# EAGLE design controller (EAGLE 5.12)
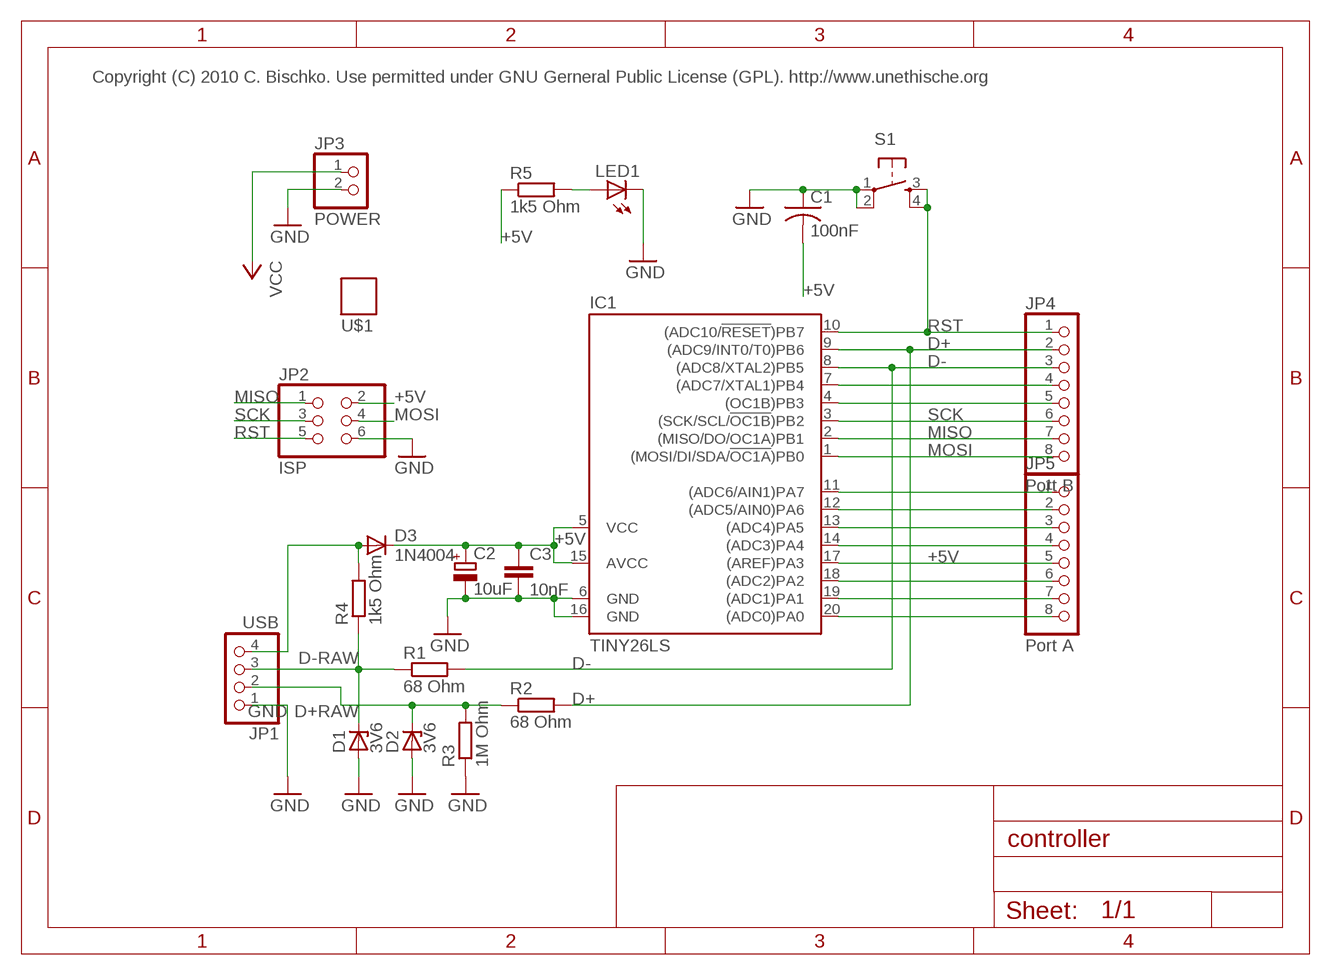
[diagram p0: schematic, sheet 1]

## Parts
C1  100nF  C-USC0805K  [C0805K]
C2  10uF  CPOL-EUE3.5-8  [E3,5-8]
C3  10nF  CAP0805  [0805]
D1  3V6  ZENER-DIODEC1702-15  [C1702-15]
D2  3V6  ZENER-DIODEC1702-15  [C1702-15]
D3  1N4004  [DO41-10]
IC1  TINY26LS  [SO20L]
JP1  USB  PINHD-1X4  [1X04]
JP2  ISP  PINHD-2X3  [2X03]
JP3  POWER  PINHD-1X2  [1X02]
JP4  Port B  PINHD-1X8  [1X08]
JP5  Port A  PINHD-1X8  [1X08]
LED1  LEDCHIPLED_0805  [CHIPLED_0805]
R1  68 Ohm  R-EU_R0805W  [R0805W]
R2  68 Ohm  R-EU_R0805W  [R0805W]
R3  1M Ohm  R-EU_R0805W  [R0805W]
R4  1k5 Ohm  R-EU_R0805W  [R0805W]
R5  1k5 Ohm  R-EU_R0805W  [R0805W]
S1  TAC_SWITCHPTH  [TACTILE-PTH]
U$1  UNETHILOGO  [UNETHILOGO]

## Nets
+5V: C1.2 C2.+ C3.1 D3.C IC1.5(VCC) IC1.15(AVCC) IC1.17((AREF)PA3) JP2.2 JP5.5 R5.1
D+: IC1.9((ADC9/INT0/T0)PB6) JP4.2 R2.2
D+RAW: D2.C JP1.2 R2.1 R3.2
D-: IC1.8((ADC8/XTAL2)PB5) JP4.3 R1.2
D-RAW: D1.C JP1.3 R1.1 R4.1
GND: C1.1 C2.- C3.2 D1.A D2.A IC1.6(GND) IC1.16(GND) JP1.1 JP2.6 JP3.2 LED1.C R3.1 S1.1 S1.2
MISO: IC1.2((MISO/DO/OC1A)PB1) JP2.1 JP4.7
MOSI: IC1.1((MOSI/DI/SDA/!OC1A!)PB0) JP2.4 JP4.8
N$3: LED1.A R5.2
N$4: IC1.7((ADC7/XTAL1)PB4) JP4.4
N$5: IC1.4((OC1B)PB3) JP4.5
N$7: IC1.20((ADC0)PA0) JP5.8
N$11: IC1.11((ADC6/AIN1)PA7) JP5.1
N$12: IC1.12((ADC5/AIN0)PA6) JP5.2
N$13: IC1.13((ADC4)PA5) JP5.3
N$14: IC1.14((ADC3)PA4) JP5.4
N$15: IC1.18((ADC2)PA2) JP5.6
N$16: IC1.19((ADC1)PA1) JP5.7
RST: IC1.10((ADC10/!RESET!)PB7) JP2.5 JP4.1 S1.3 S1.4
SCK: IC1.3((SCK/SCL/!OC1B!)PB2) JP2.3 JP4.6
VCC: D3.A JP1.4 JP3.1 R4.2

## Notes on the sheet
- Copyright (C) 2010 C. Bischko. Use permitted under GNU Gerneral Public License (GPL). http://www.unethische.org

## Library data of the parts
C1 = rcl:C-US: CAPACITOR, American symbol
C2 = rcl:CPOL-EU: POLARIZED CAPACITOR, European symbol
C3 = SparkFun:CAP: Capacitor Standard 0603 ceramic capacitor, and 0.1" leaded capacitor.
D1 D2 = diode:ZENER-DIODE: Z-Diode
D3 = diode:1N4004: DIODE general purpose rectifier, 1 A
IC1 = atmel:TINY26*: 8-bit AVR Microcontroller with 2K Bytes Flash Source: http://www.atmel.com .. doc1477.pdf
JP1 = pinhead:PINHD-1X4: PIN HEADER
JP2 = pinhead:PINHD-2X3: PIN HEADER
JP3 = pinhead:PINHD-1X2: PIN HEADER
JP4 JP5 = pinhead:PINHD-1X8: PIN HEADER
LED1 = led:LED: LED OSRAM: - CHIPLED LG R971, LG N971, LY N971, LG Q971, LY Q971, LO R971, LY R971 LH N974, LH R974 LS Q976, LO Q976, LY Q976 LO Q996 - Hyper CHIPLED LW Q18S LB Q993, LB Q99A, LB R99A - SideLED LS A670, LO A670, LY A670, LG A670, LP A670 LB A673, LV A673, LT A673, LW A673 LH A674 LY A675 LS A676, LA A676, LO A676, LY A676, LW A676 LS A679, LY A679, LG A679 - Hyper Micro SIDELED® LS Y876, LA Y876, LO Y876, LY Y876 LT Y87S - SmartLED LW L88C, LW L88S LB L89C, LB L89S, LG L890 LS L89K, LO L89K, LY L89K LS L896, LA L896, LO L896, LY L896 - TOPLED LS T670, LO T670, LY T670, LG T670, LP T670 LSG T670, LSP T670, LSY T670, LOP T670, LYG T670 LG T671, LOG T671, LSG T671 LB T673, LV T673, LT T673, LW T673 LH T674 LS T676, LA T676, LO T676, LY T676, LB T676, LH T676, LSB T676, LW T676 LB T67C, LV T67C, LT T67C, LS T67K, LO T67K, LY T67K, LW E67C LS E67B, LA E67B, LO E67B, LY E67B, LB E67C, LV E67C, LT E67C LW T67C LS T679, LY T679, LG T679 LS T770, LO T770, LY T770, LG T770, LP T770 LB T773, LV T773, LT T773, LW T773 LH T774 LS E675, LA E675, LY E675, LS T675 LS T776, LA T776, LO T776, LY T776, LB T776 LHGB T686 LT T68C, LB T68C - Hyper Mini TOPLED® LB M676 - Mini TOPLED Santana® LG M470 LS M47K, LO M47K, LY M47K Source: http://www.osram.convergy.de LUXEON: - LUMILED® LXK2-PW12-R00, LXK2-PW12-S00, LXK2-PW14-U00, LXK2-PW14-V00 LXK2-PM12-R00, LXK2-PM12-S00, LXK2-PM14-U00 LXK2-PE12-Q00, LXK2-PE12-R00, LXK2-PE12-S00, LXK2-PE14-T00, LXK2-PE14-U00 LXK2-PB12-K00, LXK2-PB12-L00, LXK2-PB12-M00, LXK2-PB14-N00, LXK2-PB14-P00, LXK2-PB14-Q00 LXK2-PR12-L00, LXK2-PR12-M00, LXK2-PR14-Q00, LXK2-PR14-R00 LXK2-PD12-Q00, LXK2-PD12-R00, LXK2-PD12-S00 LXK2-PH12-R00, LXK2-PH12-S00 LXK2-PL12-P00, LXK2-PL12-Q00, LXK2-PL12-R00 Source: www.luxeon.com KINGBRIGHT: KA-3528ASYC Source: www.kingbright.com
R1-R5 = rcl:R-EU_: RESISTOR, European symbol
S1 = SparkFun:TAC_SWITCH: Momentary Switch Button commonly used for reset or general input. Spark Fun Electronics SKU : COM-00097
U$1 = unethilogo:UNETHILOGO: UNETHI_LOGO

## Board
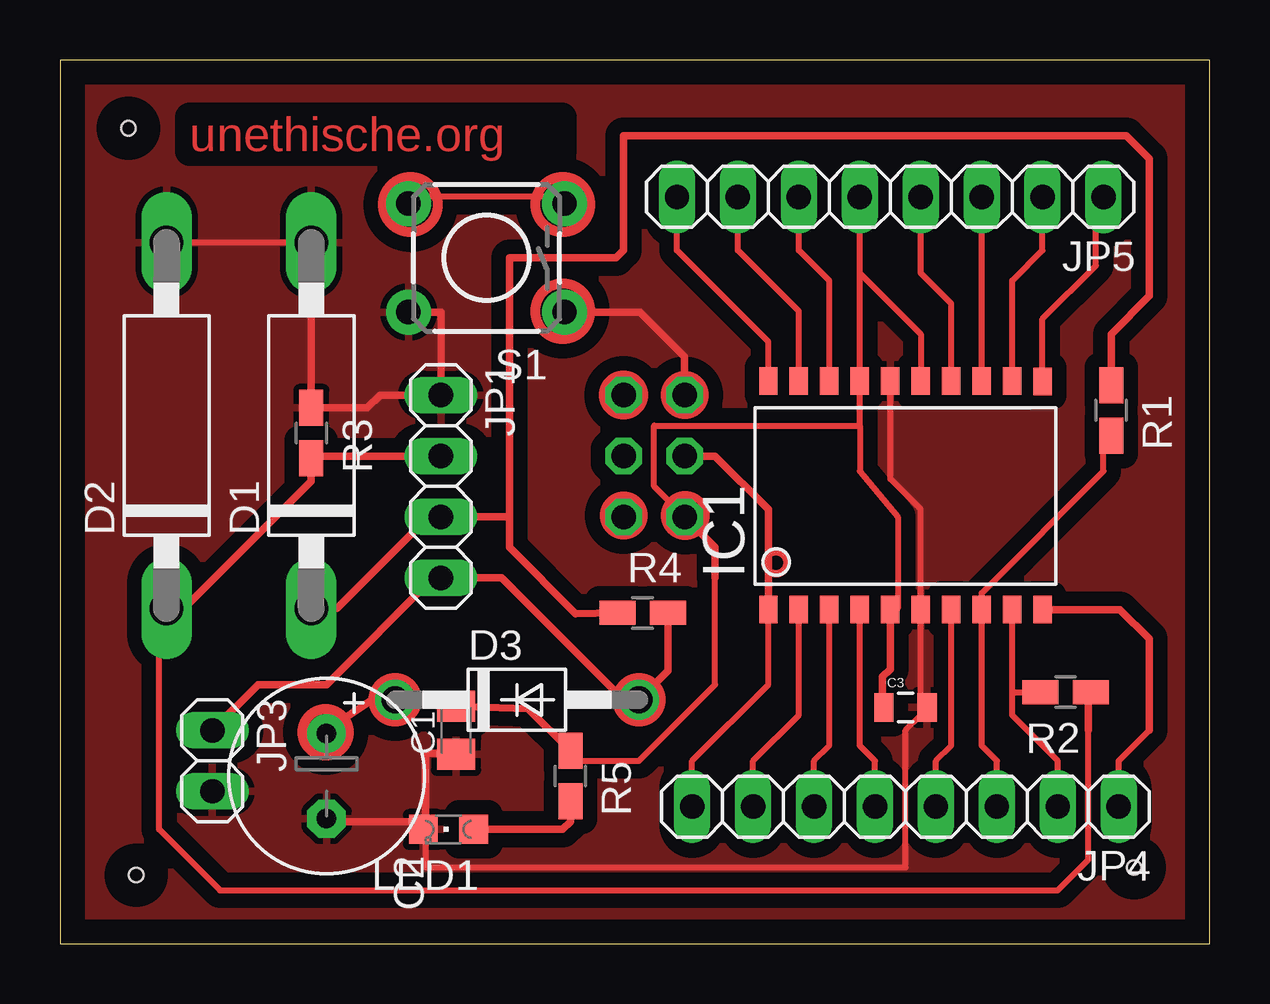
[diagram p1: board, top side]
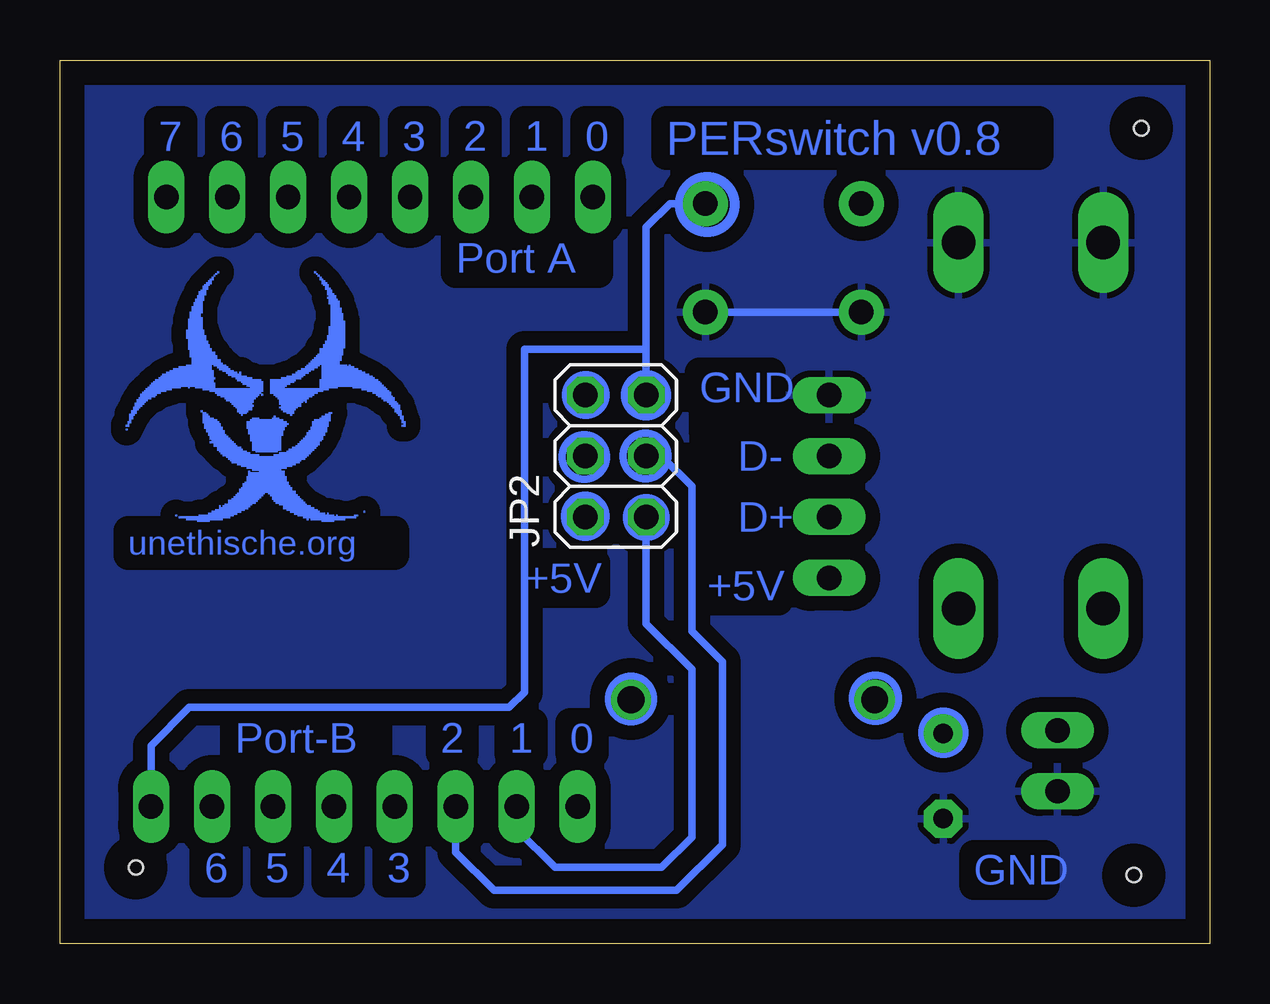
[diagram p2: board, bottom side, seen from below]

Size 47.93 x 36.82 mm. Coordinates in mm from the lower left corner, seen from the top.
Outline: 0,0 47.93,0 47.93,36.82 0,36.82 0,0
Copper layers (1*16): Top 0.035mm / dielectric 1.5mm / Bottom 0.035mm
Design rules "default": minimum track width 10mil, minimum drill 24mil, track to track 8mil, track to pad 8mil, pad to pad 8mil, via to via 8mil, smd to smd 8mil, copper to edge 40mil, drill to drill 8mil, minimum pad ring 10mil, minimum via ring 8mil, stop-mask expansion 4mil, vias tented up to drill 0mil, thermal gap 10mil
Holes 0.6 mm at 3.17,2.86 2.86,33.97 44.77,3.17

### Footprints (pad centres in the part's own frame; a part is rotated, then mirrored left to right if it is on the bottom)
C0805K = smd 1.3 x 1.6: 1 -1,0; 2 1,0
E3,5-8 = drill 0.813 pad 1.6: + -1.778,0 | drill 0.813 pad 1.6 octagon: - 1.778,0
0805 = smd 0.8 x 1.2: 1 -0.9,0; 2 0.9,0
C1702-15 = drill 1.397 long: A 7.62,0; C -7.62,0
DO41-10 = drill 1.118: A 5.08,0; C -5.08,0
SO20L = smd 0.762 x 1.143: 1 -5.08,-5.131; 2 -3.81,-5.131; 3 -2.54,-5.131; 4 -1.27,-5.131; 5 0,-5.131; 6 1.27,-5.131; 7 2.54,-5.131; 8 3.81,-5.131; 9 5.08,-5.131; 10 6.35,-5.131; 11 6.35,4.369; 12 5.08,4.394; 13 3.81,4.394; 14 2.54,4.394; 15 1.27,4.394; 16 0,4.394; 17 -1.27,4.394; 18 -2.54,4.394; 19 -3.81,4.394; 20 -5.08,4.394
1X04 = drill 1.016 long: 1 -3.81,0; 2 -1.27,0; 3 1.27,0; 4 3.81,0
2X03 = drill 1.016 octagon: 1 -2.54,-1.27; 2 -2.54,1.27; 3 0,-1.27; 4 0,1.27; 5 2.54,-1.27; 6 2.54,1.27
1X02 = drill 1.016 long: 1 -1.27,0; 2 1.27,0
1X08 = drill 1.016 long: 1 -8.89,0; 2 -6.35,0; 3 -3.81,0; 4 -1.27,0; 5 1.27,0; 6 3.81,0; 7 6.35,0; 8 8.89,0
CHIPLED_0805 = smd 1.2 x 1.2: A 0,-1.05; C 0,1.05
R0805W = smd 1.5 x 1: 1 -1.052,0; 2 1.052,0
TACTILE-PTH = drill 1.016 pad 1.88: 1 -3.251,2.261; 2 3.251,2.261; 3 -3.251,-2.261; 4 3.251,-2.261

### Placement (x,y rotation side)
C1  16.51,8.89 90 top
C2  11.11,6.99 270 top
C3  35.24,9.84 0 top
D1  10.48,21.59 90 top
D2  4.45,21.59 90 top
D3  19.05,10.16 0 top
IC1  34.61,19.05 0 top
JP1  15.88,19.05 270 top
JP2  24.77,20.32 90 bottom
JP3  6.35,7.62 270 top
JP4  35.24,5.71 180 top
JP5  34.61,31.11 180 top
LED1  16.19,4.76 90 top
R1  43.81,22.23 270 top
R2  41.91,10.48 180 top
R3  10.48,21.27 270 top
R4  24.28,13.78 0 top
R5  21.27,6.99 270 top
S1  17.78,28.57 180 top
U$1  33.34,17.46 0 top

### Tracks (layer width: path | path; a pad name or v marks a point on that pad's centre or on a via)
+5V
  Top 0.254: C2.+ 11.11,8.89 | 33.34,27.94 JP5.5 | 33.34,27.94 35.88,25.4 IC1.15 | 33.34,21.59 33.34,19.68 34.92,17.78 34.92,13.97 IC1.5 | 33.34,21.59 IC1.17 | 33.34,23.5 33.34,27.94 | 27.3,15.24 27.3,10.79 24.13,7.62 21.59,7.62 R5.1 | JP2.2 24.77,19.05 24.77,21.59 33.34,21.59
  Top 0.305: 11.11,8.89 13.02,10.16 D3.C 16.14,10.16 C1.2 19.52,9.79 R5.1 | 27.3,15.24 27.3,16.51 JP2.2 | IC1.5 34.61,11.43 34.29,11.11 34.29,9.89 C3.1
  Top 0.406: IC1.17 33.34,23.5
D+
  Top 0.254: 39.69,10.48 IC1.9 39.69,13.97 | JP4.2 41.59,7.62 39.69,9.53 39.69,10.48 | 39.69,10.48 R2.2
D+RAW
  Top 0.254: D2.C 4.13,13.97 4.13,4.76 6.67,2.22 41.59,2.22 42.86,3.49 42.86,8.89 | 15.56,20.32 JP1.2 15.88,20.54
  Top 0.305: 4.13,13.97 5.17,13.97 10.48,19.27 R3.2 10.58,20.32 JP1.2 | 42.86,8.89 42.86,10.38 R2.1
D-
  Top 0.254: JP4.3 39.05,7.62 38.42,8.26 IC1.8 38.42,14.61 43.5,19.68 43.5,20.95 R1.2
D-RAW
  Top 0.254: 16.19,17.78 JP1.3 15.56,17.78 | R1.1 44.13,23.5
  Top 0.305: R4.1 21.49,13.75 18.73,16.51 18.73,17.78 | 43.72,23.18 R1.1 43.81,25.4 45.4,26.99 45.4,32.7 44.45,33.66 23.5,33.66 23.5,28.89 23.18,28.57 18.73,28.57 18.73,17.78 | D1.C 11.56,13.97 15.3,17.72 15.81,17.72 JP1.3 | 16.19,17.78 18.73,17.78
GND
  Top 0.254: D1.A D2.A | 34.61,23.5 IC1.16 34.61,19.37 35.88,18.1 IC1.6 35.88,9.53 35.24,8.89 35.24,3.17 15.24,3.17 15.24,4.76
  Top 0.305: LED1.C 15.24,5.08 | LED1.C 15.24,4.76 | 15.24,5.08 11.11,5.08 | C1.1 16.51,7.94 15.24,7.94 15.24,5.08 | 15.24,5.08 15.24,4.86 LED1.C | S1.2 15.88,26.31 JP1.1 13.34,22.86 12.8,22.32 R3.1 D1.A | S1.1 24.17,26.31 26.04,24.45 JP2.6
  Bottom 0.305: S1.2 S1.1
  pour Bottom (isolate 0.61): -1.59,37.78 49.21,37.78 49.53,-0.95 -1.27,-0.95
  pour Top (isolate 0.61): -0.64,37.15 48.58,37.15 48.58,-0.32 -0.64,-0.32
MISO
  Top 0.254: 30.8,13.97 IC1.2 30.8,9.53 28.89,7.62 JP4.7
  Bottom 0.305: JP4.7 28.89,4.76 27.3,3.17 22.86,3.17 21.59,4.45 21.59,11.43 23.5,13.34 JP2.1
MOSI
  Top 0.254: 29.53,13.97 IC1.1 29.53,10.79 26.35,7.62 JP4.8
  Top 0.305: JP2.4 27.3,20.32 29.53,18.1 IC1.1
N$3
  Top 0.305: LED1.A 20.95,4.76 21.27,5.08 R5.2
N$4
  Top 0.254: 37.15,13.97 IC1.7 37.15,8.26 36.51,7.62 JP4.4
N$5
  Top 0.254: 33.34,13.97 IC1.4 33.34,8.26 33.97,7.62 JP4.5
N$7
  Top 0.254: JP5.8 25.72,28.89 29.53,25.08 IC1.20
N$8
  pour Bottom (isolate 0.61): 21.91,23.18 46.04,22.86 46.04,3.17 21.59,3.49
N$11
  Top 0.254: JP5.1 43.18,30.8 43.18,28.26 40.96,26.04 IC1.11
N$12
  Top 0.254: JP5.2 40.96,28.89 39.69,27.62 IC1.12
N$13
  Top 0.254: IC1.13 JP5.3
N$14
  Top 0.254: JP5.4 35.88,27.94 37.15,26.67 IC1.14
N$15
  Top 0.254: JP5.6 30.8,28.89 32.07,27.62 IC1.18
N$16
  Top 0.254: JP5.7 28.26,28.89 30.8,26.35 IC1.19
RST
  Top 0.254: 45.4,8.89 44.13,7.62 JP4.1 | S1.4 14.92,31.11 20.64,31.11 S1.3
  Top 0.305: IC1.10 44.18,13.92 45.4,12.7 45.4,8.89
  Bottom 0.254: JP4.1 44.45,5.71
  Bottom 0.305: S1.3 22.5,30.84 23.5,29.84 23.5,24.77 | 23.5,24.77 28.57,24.77 28.57,10.48 29.21,9.84 42.55,9.84 44.13,8.26 JP4.1 | 23.5,24.77 JP2.5
SCK
  Top 0.254: 32.07,13.97 IC1.3 32.07,8.26 31.43,7.62 JP4.6
  Bottom 0.305: JP2.3 22.86,20.32 21.59,19.05 21.59,13.02 20.32,11.75 20.32,4.13 22.23,2.22 29.84,2.22 31.43,3.81 JP4.6
VCC
  Top 0.254: D3.A 23.81,10.16
  Top 0.305: R4.2 25.34,11.37 D3.A 23.5,10.16 18.41,15.24 JP1.4 15.56,15.24 11.11,10.79 8.26,10.79 JP3.1
(copper drawn outside any net)
  shapes: Bottom circle x10, Top circle x11

### Text on the board
Top: unethische.org
Bottom: PERswitch v0.8 | 0 | 1 | 2 | 3 | 4 | 5 | 6 | 7 | Port A | GND | D- | D+ | unethische.org | +5V | +5V | 0 | 1 | 2 | Port-B | 3 | 4 | 5 | 6 | GND